# EAGLE schematic main (EAGLE 8.3.2)
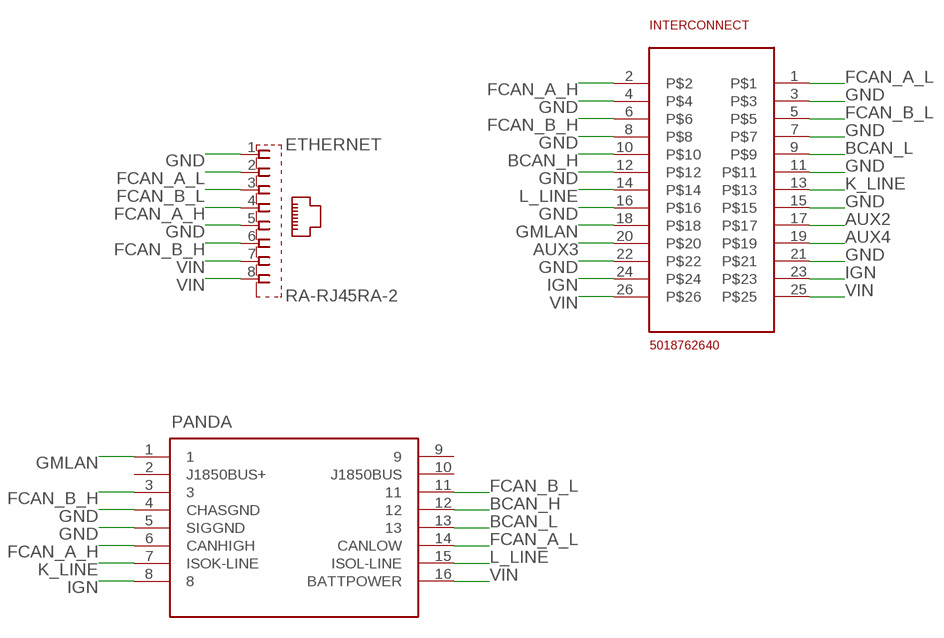
[diagram p0: schematic, sheet 1]

## Parts
ETHERNET  RA-RJ45RA-2  [RA-RJ45-2]
INTERCONNECT  5018762640  [5018762640]
PANDA  OBDII-FEMALEFEMALE  [OBDII-FEMALE]

## Nets
AUX2: INTERCONNECT.17
AUX3: INTERCONNECT.20
AUX4: INTERCONNECT.19
BCAN_H: INTERCONNECT.10 PANDA.12
BCAN_L: INTERCONNECT.9 PANDA.13
FCAN_A_H: ETHERNET.4 INTERCONNECT.2 PANDA.6(CANHIGH)
FCAN_A_L: ETHERNET.2 INTERCONNECT.1 PANDA.14(CANLOW)
FCAN_B_H: ETHERNET.6 INTERCONNECT.6 PANDA.3
FCAN_B_L: ETHERNET.3 INTERCONNECT.5 PANDA.11
GMLAN: INTERCONNECT.18 PANDA.1
GND [PWR]: ETHERNET.1 ETHERNET.5 INTERCONNECT.3 INTERCONNECT.4 INTERCONNECT.7 INTERCONNECT.8 INTERCONNECT.11 INTERCONNECT.12 INTERCONNECT.15 INTERCONNECT.16 INTERCONNECT.21 INTERCONNECT.22 PANDA.4(CHASGND) PANDA.5(SIGGND)
IGN [PWR]: INTERCONNECT.23 INTERCONNECT.24 PANDA.8
K_LINE: INTERCONNECT.13 PANDA.7(ISOK-LINE)
L_LINE: INTERCONNECT.14 PANDA.15(ISOL-LINE)
VIN [PWR]: ETHERNET.7 ETHERNET.8 INTERCONNECT.25 INTERCONNECT.26 PANDA.16(BATTPOWER)
Unconnected: PANDA.2(J1850BUS+) PANDA.9 PANDA.10(J1850BUS)

## Library data of the parts
ETHERNET = comma.ai:RA-RJ45
INTERCONNECT = Souers:5018762640
PANDA = comma.ai:OBDII-FEMALE

## Net classes
1 PWR: width 0.813 mm, clearance 0.127 mm